# Altium schematic sheet INC-IO1212001.SchDoc
size A2
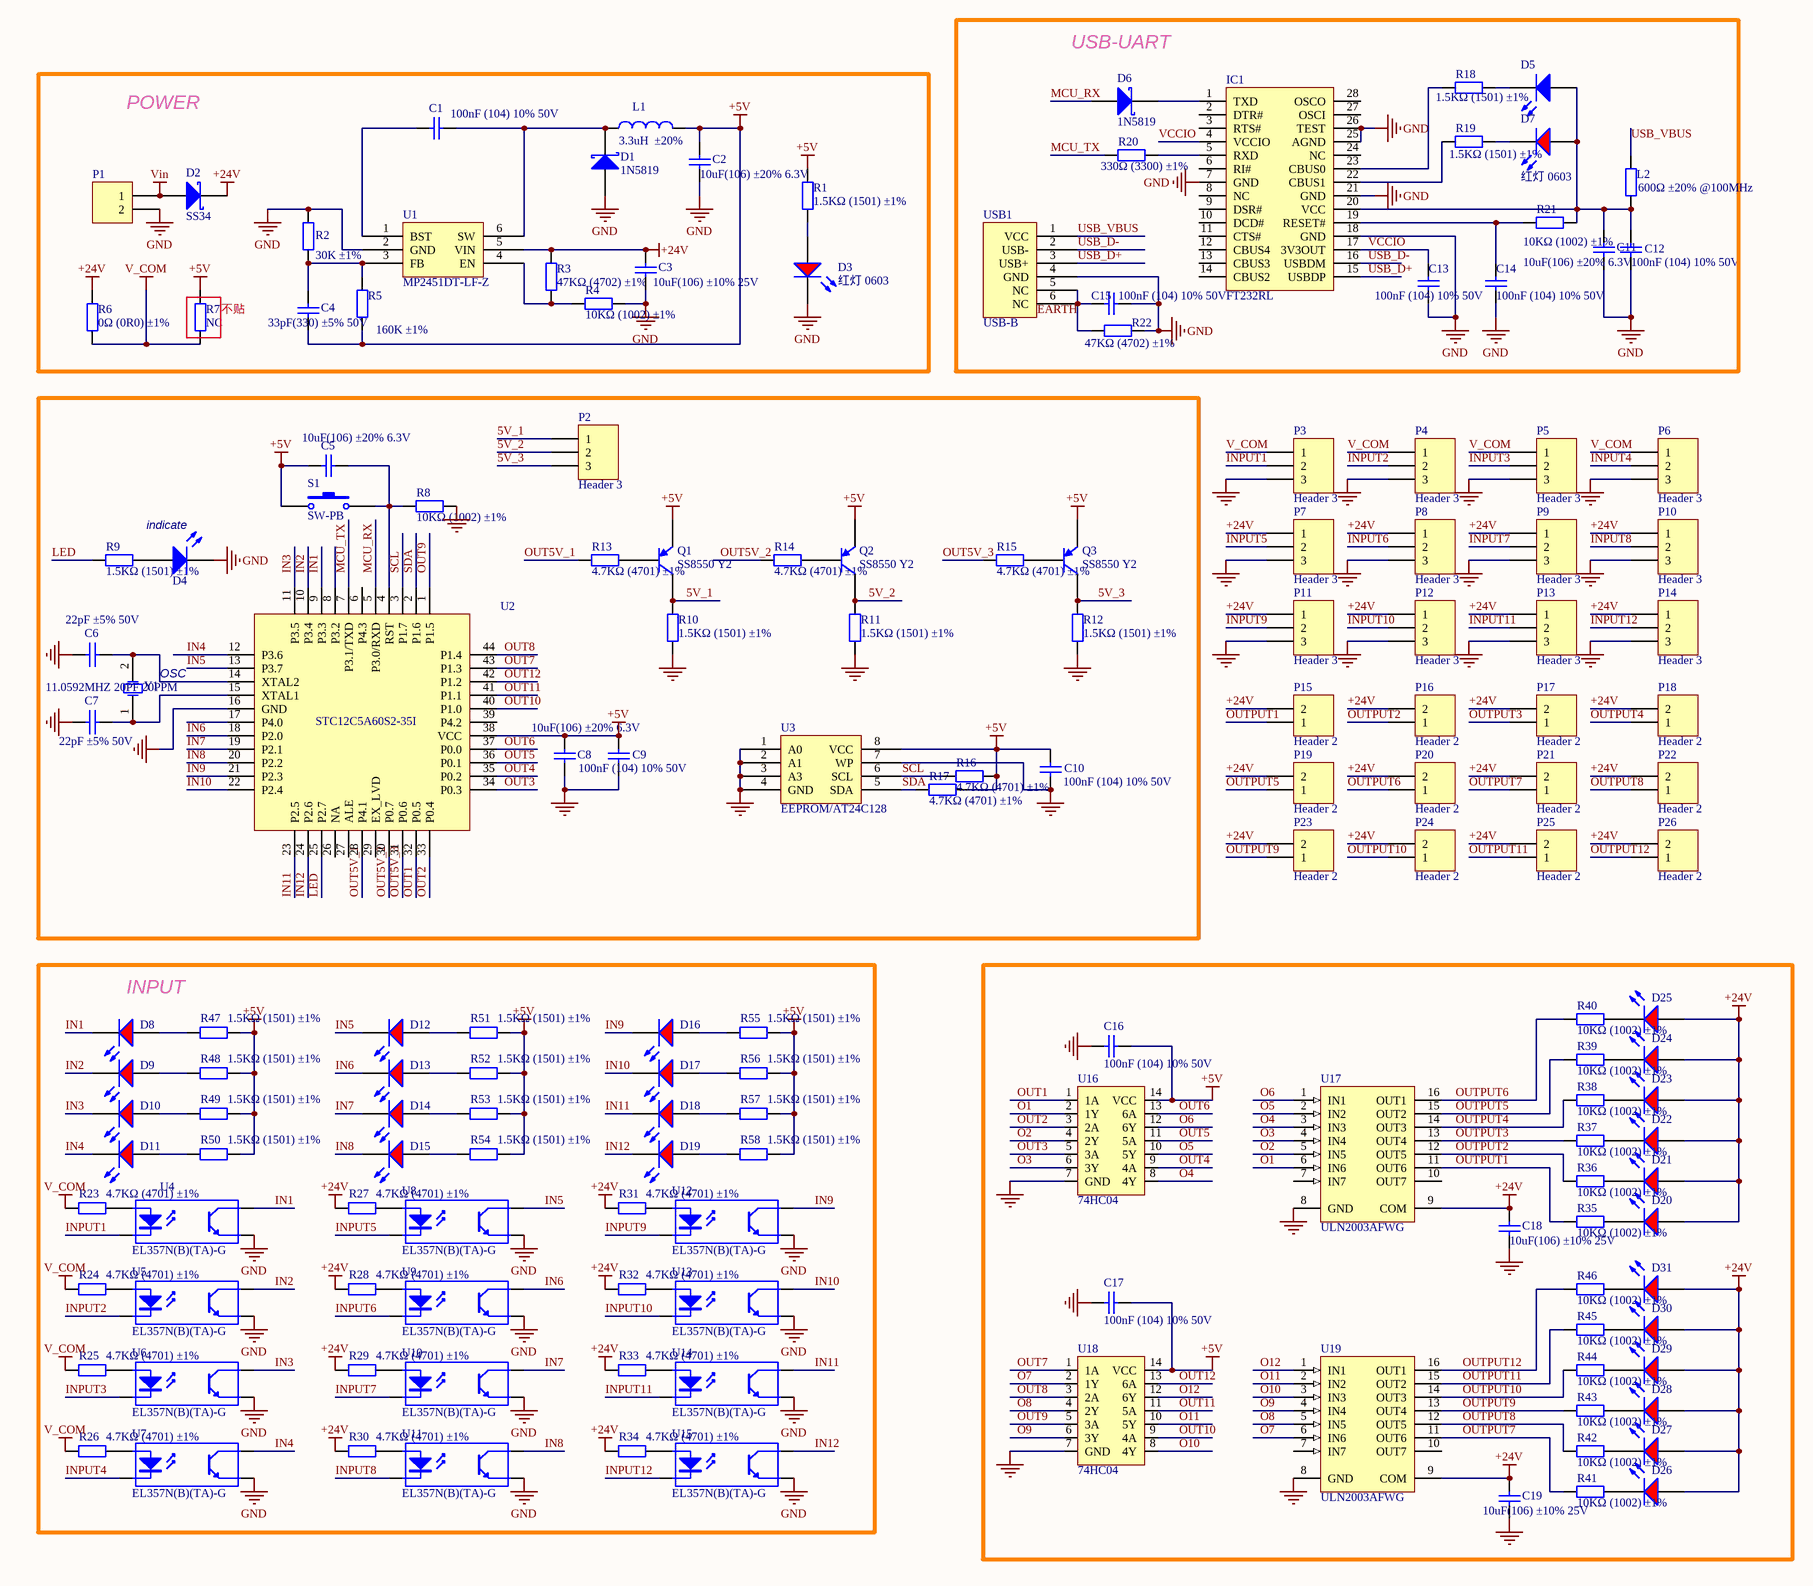
[diagram p0: INC-IO1212001.SchDoc]

## Parts
C1  100nF (104) 10% 50V  [0603_C]
C2  10uF(106) ±20% 6.3V  [0603_C]
C3  10uF(106) ±10% 25V  [1206_C]
C4  33pF(330) ±5% 50V  [0603_C]
C5  10uF(106) ±20% 6.3V  [0603_C]
C6  22pF ±5% 50V  [0603_C]
C7  22pF ±5% 50V  [0603_C]
C8  10uF(106) ±20% 6.3V  [0603_C]
C9  100nF (104) 10% 50V  [0603_C]
C10  100nF (104) 10% 50V  [0603_C]
C11  10uF(106) ±20% 6.3V  [0603_C]
C12  100nF (104) 10% 50V  [0603_C]
C13  100nF (104) 10% 50V  [0603_C]
C14  100nF (104) 10% 50V  [0603_C]
C15  100nF (104) 10% 50V  [0603_C]
C16  100nF (104) 10% 50V  [0603_C]
C17  100nF (104) 10% 50V  [0603_C]
C18  10uF(106) ±10% 25V  [1206_C]
C19  10uF(106) ±10% 25V  [1206_C]
D1  1N5819  [SOD-123]
D2  SS34  [SMA(DO-214AC)_S1]
D3  红灯 0603  [0603_LED_S1]
D4  蓝灯 0603  [0603_LED_S1]  (value not drawn)
D5  蓝灯 0603  [0603_LED_S1]  (value not drawn)
D6  1N5819  [SOD-123]
D7  红灯 0603  [0603_LED_S1]
D8  红灯 0603  [0603_LED_S1]  (value not drawn)
D9  红灯 0603  [0603_LED_S1]  (value not drawn)
D10  红灯 0603  [0603_LED_S1]  (value not drawn)
D11  红灯 0603  [0603_LED_S1]  (value not drawn)
D12  红灯 0603  [0603_LED_S1]  (value not drawn)
D13  红灯 0603  [0603_LED_S1]  (value not drawn)
D14  红灯 0603  [0603_LED_S1]  (value not drawn)
D15  红灯 0603  [0603_LED_S1]  (value not drawn)
D16  红灯 0603  [0603_LED_S1]  (value not drawn)
D17  红灯 0603  [0603_LED_S1]  (value not drawn)
D18  红灯 0603  [0603_LED_S1]  (value not drawn)
D19  红灯 0603  [0603_LED_S1]  (value not drawn)
D20  红灯 0603  [0603_LED_S1]  (value not drawn)
D21  红灯 0603  [0603_LED_S1]  (value not drawn)
D22  红灯 0603  [0603_LED_S1]  (value not drawn)
D23  红灯 0603  [0603_LED_S1]  (value not drawn)
D24  红灯 0603  [0603_LED_S1]  (value not drawn)
D25  红灯 0603  [0603_LED_S1]  (value not drawn)
D26  红灯 0603  [0603_LED_S1]  (value not drawn)
D27  红灯 0603  [0603_LED_S1]  (value not drawn)
D28  红灯 0603  [0603_LED_S1]  (value not drawn)
D29  红灯 0603  [0603_LED_S1]  (value not drawn)
D30  红灯 0603  [0603_LED_S1]  (value not drawn)
D31  红灯 0603  [0603_LED_S1]  (value not drawn)
IC1  FT232RL  [SSOP-28_208mil]
L1  3.3uH  ±20%  [L5020]
L2  600Ω ±20% @100MHz  [0805_L]
P1  Header 2  [GX-2P-3.81MM]  (value not drawn)
P2  Header 3  [GX-3P-3.81MM]
P3  Header 3  [GX-3P-3.81MM]
P4  Header 3  [GX-3P-3.81MM]
P5  Header 3  [GX-3P-3.81MM]
P6  Header 3  [GX-3P-3.81MM]
P7  Header 3  [GX-3P-3.81MM]
P8  Header 3  [GX-3P-3.81MM]
P9  Header 3  [GX-3P-3.81MM]
P10  Header 3  [GX-3P-3.81MM]
P11  Header 3  [GX-3P-3.81MM]
P12  Header 3  [GX-3P-3.81MM]
P13  Header 3  [GX-3P-3.81MM]
P14  Header 3  [GX-3P-3.81MM]
P15  Header 2  [GX-2P-3.81MM]
P16  Header 2  [GX-2P-3.81MM]
P17  Header 2  [GX-2P-3.81MM]
P18  Header 2  [GX-2P-3.81MM]
P19  Header 2  [GX-2P-3.81MM]
P20  Header 2  [GX-2P-3.81MM]
P21  Header 2  [GX-2P-3.81MM]
P22  Header 2  [GX-2P-3.81MM]
P23  Header 2  [GX-2P-3.81MM]
P24  Header 2  [GX-2P-3.81MM]
P25  Header 2  [GX-2P-3.81MM]
P26  Header 2  [GX-2P-3.81MM]
Q1  SS8550 Y2  [SOT-23(SOT-23-3)]
Q2  SS8550 Y2  [SOT-23(SOT-23-3)]
Q3  SS8550 Y2  [SOT-23(SOT-23-3)]
R1  1.5KΩ (1501) ±1%  [0603_R]
R2  30K ±1%  [0603_R]
R3  47KΩ (4702) ±1%  [0603_R]
R4  10KΩ (1002) ±1%  [0603_R]
R5  160K ±1%  [0603_R]
R6  0Ω (0R0) ±1%  [0603_R]
R7  NC  [0603_R]
R8  10KΩ (1002) ±1%  [0603_R]
R9  1.5KΩ (1501) ±1%  [0603_R]
R10  1.5KΩ (1501) ±1%  [0603_R]
R11  1.5KΩ (1501) ±1%  [0603_R]
R12  1.5KΩ (1501) ±1%  [0603_R]
R13  4.7KΩ (4701) ±1%  [0603_R]
R14  4.7KΩ (4701) ±1%  [0603_R]
R15  4.7KΩ (4701) ±1%  [0603_R]
R16  4.7KΩ (4701) ±1%  [0603_R]
R17  4.7KΩ (4701) ±1%  [0603_R]
R18  1.5KΩ (1501) ±1%  [0603_R]
R19  1.5KΩ (1501) ±1%  [0603_R]
R20  330Ω (3300) ±1%  [0603_R]
R21  10KΩ (1002) ±1%  [0603_R]
R22  47KΩ (4702) ±1%  [0603_R]
R23  4.7KΩ (4701) ±1%  [1210_R]
R24  4.7KΩ (4701) ±1%  [1210_R]
R25  4.7KΩ (4701) ±1%  [1210_R]
R26  4.7KΩ (4701) ±1%  [1210_R]
R27  4.7KΩ (4701) ±1%  [1210_R]
R28  4.7KΩ (4701) ±1%  [1210_R]
R29  4.7KΩ (4701) ±1%  [1210_R]
R30  4.7KΩ (4701) ±1%  [1210_R]
R31  4.7KΩ (4701) ±1%  [1210_R]
R32  4.7KΩ (4701) ±1%  [1210_R]
R33  4.7KΩ (4701) ±1%  [1210_R]
R34  4.7KΩ (4701) ±1%  [1210_R]
R35  10KΩ (1002) ±1%  [0603_R]
R36  10KΩ (1002) ±1%  [0603_R]
R37  10KΩ (1002) ±1%  [0603_R]
R38  10KΩ (1002) ±1%  [0603_R]
R39  10KΩ (1002) ±1%  [0603_R]
R40  10KΩ (1002) ±1%  [0603_R]
R41  10KΩ (1002) ±1%  [0603_R]
R42  10KΩ (1002) ±1%  [0603_R]
R43  10KΩ (1002) ±1%  [0603_R]
R44  10KΩ (1002) ±1%  [0603_R]
R45  10KΩ (1002) ±1%  [0603_R]
R46  10KΩ (1002) ±1%  [0603_R]
R47  1.5KΩ (1501) ±1%  [0603_R]
R48  1.5KΩ (1501) ±1%  [0603_R]
R49  1.5KΩ (1501) ±1%  [0603_R]
R50  1.5KΩ (1501) ±1%  [0603_R]
R51  1.5KΩ (1501) ±1%  [0603_R]
R52  1.5KΩ (1501) ±1%  [0603_R]
R53  1.5KΩ (1501) ±1%  [0603_R]
R54  1.5KΩ (1501) ±1%  [0603_R]
R55  1.5KΩ (1501) ±1%  [0603_R]
R56  1.5KΩ (1501) ±1%  [0603_R]
R57  1.5KΩ (1501) ±1%  [0603_R]
R58  1.5KΩ (1501) ±1%  [0603_R]
S1  SW-PB  [SW-3*6*2.5]
U1  MP2451DT-LF-Z  [SOT-23-6]
U2  STC12C5A60S2-35I  [LQFP-44_10x10x08P]
U3  EEPROM/AT24C128  [SOIC-8_150mil]
U4  EL357N(B)(TA)-G  [SOP-4_P2.54]
U5  EL357N(B)(TA)-G  [SOP-4_P2.54]
U6  EL357N(B)(TA)-G  [SOP-4_P2.54]
U7  EL357N(B)(TA)-G  [SOP-4_P2.54]
U8  EL357N(B)(TA)-G  [SOP-4_P2.54]
U9  EL357N(B)(TA)-G  [SOP-4_P2.54]
U10  EL357N(B)(TA)-G  [SOP-4_P2.54]
U11  EL357N(B)(TA)-G  [SOP-4_P2.54]
U12  EL357N(B)(TA)-G  [SOP-4_P2.54]
U13  EL357N(B)(TA)-G  [SOP-4_P2.54]
U14  EL357N(B)(TA)-G  [SOP-4_P2.54]
U15  EL357N(B)(TA)-G  [SOP-4_P2.54]
U16  74HC04  [SOIC-14_150mil]
U17  ULN2003AFWG  [SOIC-16_150mil]
U18  74HC04  [SOIC-14_150mil]
U19  ULN2003AFWG  [SOIC-16_150mil]
USB1  USB-B  [USB-b]
Y1  11.0592MHZ 20PF 20PPM  [SMD-5032_2P]

## Blocks framed on the sheet
USB-UART: C11-C15 D5-D7 IC1 L2 R18-R22 USB1
POWER: C1-C4 D1-D3 L1 P1 R1-R7 U1
INPUT: D8-D19 R23-R34 R47-R58 U4-U15

## Nets
+5V: C2.2 C4.2 C5.2 C8.1 C9.1 C10.1 C16.2 C17.2 L1.2 Q1.2(E) Q2.2(E) Q3.2(E) R1.1 R5.2 R7.2 R16.2 R17.2 R47.2 R48.2 R49.2 R50.2 R51.2 R52.2 R53.2 R54.2 R55.2 R56.2 R57.2 R58.2 S1.1 U2.38(VCC) U3.8(VCC) U16.14(VCC) U18.14(VCC)
+24V: C3.2 C18.2 C19.2 D2.2(K) D20.A D21.A D22.A D23.A D24.A D25.A D26.A D27.A D28.A D29.A D30.A D31.A P7.1 P8.1 P9.1 P10.1 P11.1 P12.1 P13.1 P14.1 P15.2 P16.2 P17.2 P18.2 P19.2 P20.2 P21.2 P22.2 P23.2 P24.2 P25.2 P26.2 R3.1 R6.2 R27.1 R28.1 R29.1 R30.1 R31.1 R32.1 R33.1 R34.1 U1.5(VIN) U17.9(COM) U19.9(COM)
GND: C2.1 C3.1 C6.2 C7.2 C8.2 C9.2 C10.2 C11.1 C12.1 C13.1 C14.1 C15.2 C16.1 C17.1 C18.1 C19.1 D1.1(A) D3.K D4.K IC1.7(GND) IC1.18(GND) IC1.21(GND) IC1.25(AGND) IC1.26(TEST) P1.2 P3.3 P4.3 P5.3 P6.3 P7.3 P8.3 P9.3 P10.3 P11.3 P12.3 P13.3 P14.3 R2.1 R4.2 R8.2 R10.1 R11.1 R12.1 R22.1 U1.2(GND) U2.16(GND) U3.1(A0) U3.2(A1) U3.3(A3) U3.4(GND) U3.7(WP) U4.3(E) U5.3(E) U6.3(E) U7.3(E) U8.3(E) U9.3(E) U10.3(E) U11.3(E) U12.3(E) U13.3(E) U14.3(E) U15.3(E) U16.7(GND) U17.8(GND) U18.7(GND) U19.8(GND) USB1.4(GND)
V_COM: P3.1 P4.1 P5.1 P6.1 R6.1 R7.1 R23.1 R24.1 R25.1 R26.1
Vin: D2.1(A) P1.1
5V_1: P2.1 Q1.3(C) R10.2
5V_2: P2.2 Q2.3(C) R11.2
5V_3: P2.3 Q3.3(C) R12.2
IN1: D8.K U2.9(P3.3) U4.4(C)
IN2: D9.K U2.10(P3.4) U5.4(C)
IN3: D10.K U2.11(P3.5) U6.4(C)
IN4: D11.K U2.12(P3.6) U7.4(C)
IN5: D12.K U2.13(P3.7) U8.4(C)
IN6: D13.K U2.18(P2.0) U9.4(C)
IN7: D14.K U2.19(P2.1) U10.4(C)
IN8: D15.K U2.20(P2.2) U11.4(C)
IN9: D16.K U2.21(P2.3) U12.4(C)
IN10: D17.K U2.22(P2.4) U13.4(C)
IN11: D18.K U2.23(P2.5) U14.4(C)
IN12: D19.K U2.24(P2.6) U15.4(C)
INPUT1: P3.2 U4.2(K)
INPUT2: P4.2 U5.2(K)
INPUT3: P5.2 U6.2(K)
INPUT4: P6.2 U7.2(K)
INPUT5: P7.2 U8.2(K)
INPUT6: P8.2 U9.2(K)
INPUT7: P9.2 U10.2(K)
INPUT8: P10.2 U11.2(K)
INPUT9: P11.2 U12.2(K)
INPUT10: P12.2 U13.2(K)
INPUT11: P13.2 U14.2(K)
INPUT12: P14.2 U15.2(K)
LED: R9.2 U2.25(P2.7)
MCU_RX: D6.1(A) U2.5(P3.0/RXD)
MCU_TX: R20.2 U2.7(P3.1/TXD)
O1: U16.2(1Y) U17.6(IN6)
O2: U16.4(2Y) U17.5(IN5)
O3: U16.6(3Y) U17.4(IN4)
O4: U16.8(4Y) U17.3(IN3)
O5: U16.10(5Y) U17.2(IN2)
O6: U16.12(6Y) U17.1(IN1)
O7: U18.2(1Y) U19.6(IN6)
O8: U18.4(2Y) U19.5(IN5)
O9: U18.6(3Y) U19.4(IN4)
O10: U18.8(4Y) U19.3(IN3)
O11: U18.10(5Y) U19.2(IN2)
O12: U18.12(6Y) U19.1(IN1)
OUT1: U2.32(P0.5) U16.1(1A)
OUT2: U2.33(P0.4) U16.3(2A)
OUT3: U2.34(P0.3) U16.5(3A)
OUT4: U2.35(P0.2) U16.9(4A)
OUT5: U2.36(P0.1) U16.11(5A)
OUT5V_1: R13.1 U2.28(P4.1)
OUT5V_2: R14.1 U2.30(P0.7)
OUT5V_3: R15.1 U2.31(P0.6)
OUT6: U2.37(P0.0) U16.13(6A)
OUT7: U2.43(P1.3) U18.1(1A)
OUT8: U2.44(P1.4) U18.3(2A)
OUT9: U2.1(P1.5) U18.5(3A)
OUT10: U2.40(P1.0) U18.9(4A)
OUT11: U2.41(P1.1) U18.11(5A)
OUT12: U2.42(P1.2) U18.13(6A)
OUTPUT1: P15.1 R35.1 U17.11(OUT6)
OUTPUT2: P16.1 R36.1 U17.12(OUT5)
OUTPUT3: P17.1 R37.1 U17.13(OUT4)
OUTPUT4: P18.1 R38.1 U17.14(OUT3)
OUTPUT5: P19.1 R39.1 U17.15(OUT2)
OUTPUT6: P20.1 R40.1 U17.16(OUT1)
OUTPUT7: P21.1 R41.1 U19.11(OUT6)
OUTPUT8: P22.1 R42.1 U19.12(OUT5)
OUTPUT9: P23.1 R43.1 U19.13(OUT4)
OUTPUT10: P24.1 R44.1 U19.14(OUT3)
OUTPUT11: P25.1 R45.1 U19.15(OUT2)
OUTPUT12: P26.1 R46.1 U19.16(OUT1)
SCL: R16.1 U2.3(P1.7) U3.6(SCL)
SDA: R17.1 U2.2(P1.6) U3.5(SDA)
USB_D+: IC1.15(USBDP) USB1.3(USB+)
USB_D-: IC1.16(USBDM) USB1.2(USB-)
USB_VBUS: L2.2 USB1.1(VCC)
VCCIO: C13.2 IC1.4(VCCIO) IC1.17(3V3OUT)
NetC1_1: C1.1 D1.2(K) L1.1 U1.6(SW)
NetC1_2: C1.2 U1.1(BST)
NetC4_1: C4.1 R2.2 R5.1 U1.3(FB)
NetC5_1: C5.1 R8.1 S1.2 U2.4(RST)
NetC6_1: C6.1 U2.14(XTAL2) Y1.2(OSC2)
NetC7_1: C7.1 U2.15(XTAL1) Y1.1(OSC1)
NetC11_2: C11.2 C12.2 D5.A D7.A IC1.20(VCC) L2.1 R21.1
NetC14_2: C14.2 IC1.19(RESET#) R21.2
NetC15_1: C15.1 R22.2 USB1.5(NC) USB1.6(NC)
NetD3_A: D3.A R1.2
NetD4_A: D4.A R9.1
NetD5_K: D5.K R18.2
NetD6_2: D6.2(K) IC1.1(TXD)
NetD7_K: D7.K R19.2
NetD8_A: D8.A R47.1
NetD9_A: D9.A R48.1
NetD10_A: D10.A R49.1
NetD11_A: D11.A R50.1
NetD12_A: D12.A R51.1
NetD13_A: D13.A R52.1
NetD14_A: D14.A R53.1
NetD15_A: D15.A R54.1
NetD16_A: D16.A R55.1
NetD17_A: D17.A R56.1
NetD18_A: D18.A R57.1
NetD19_A: D19.A R58.1
NetD20_K: D20.K R35.2
NetD21_K: D21.K R36.2
NetD22_K: D22.K R37.2
NetD23_K: D23.K R38.2
NetD24_K: D24.K R39.2
NetD25_K: D25.K R40.2
NetD26_K: D26.K R41.2
NetD27_K: D27.K R42.2
NetD28_K: D28.K R43.2
NetD29_K: D29.K R44.2
NetD30_K: D30.K R45.2
NetD31_K: D31.K R46.2
NetIC1_5: IC1.5(RXD) R20.1
NetIC1_22: IC1.22(CBUS1) R19.1
NetIC1_23: IC1.23(CBUS0) R18.1
NetQ1_1: Q1.1(B) R13.2
NetQ2_1: Q2.1(B) R14.2
NetQ3_1: Q3.1(B) R15.2
NetR3_2: R3.2 R4.1 U1.4(EN)
NetR23_2: R23.2 U4.1(A)
NetR24_2: R24.2 U5.1(A)
NetR25_2: R25.2 U6.1(A)
NetR26_2: R26.2 U7.1(A)
NetR27_2: R27.2 U8.1(A)
NetR28_2: R28.2 U9.1(A)
NetR29_2: R29.2 U10.1(A)
NetR30_2: R30.2 U11.1(A)
NetR31_2: R31.2 U12.1(A)
NetR32_2: R32.2 U13.1(A)
NetR33_2: R33.2 U14.1(A)
NetR34_2: R34.2 U15.1(A)

Not connected (* = marked no-connect by the designer): IC1 2(DTR#) 3(RTS#) 6(RI#) 8(NC) 9(DSR#) 10(DCD#) 11(CTS#) 12(CBUS4) 13(CBUS3) 14(CBUS2) 24(NC) 27(OSCI) 28(OSCO); U2 6(P4.3) 8(P3.2) 17(P4.0) 26(NA) 27(ALE) 29(EX_LVD) 39(P4.2); U17 7(IN7) 10(OUT7); U19 7(IN7) 10(OUT7)

## Notes on the sheet
- (near R7) 不贴
- indicate
- (near Y1) OSC
- Labels drawn without touching a wire or pin: EARTH

## Library data of the parts
C1 C4 = 0603 10nF (103) 10% 50V: 贴片电容; ComponentLink1Description: 供应商链接; ComponentLink1URL: http://www.szlcsc.com/product/details_58143.html; Package: 0603; Supplier: LC; SuppliersPartNumber: C57112
C2 C3 C12-C15 C18 = Cap: Capacitor; Published: 8-Jun-2000; LatestRevisionDate: 17-Jul-2002; LatestRevisionNote: Re-released for DXP Platform.; PackageReference: RAD-0.3; Publisher: Altium Limited
  C2: Value: 10uF(106) ±20% 6.3V
  C3 C18: Value: 10uF(106) ±10% 25V
  C12-C15: Value: 100nF (104) 10% 50V
C5 = 0603 10uF (106) 10% 10V: 贴片电容; ComponentLink1Description: 供应商链接; ComponentLink1URL: http://www.szlcsc.com/product/details_20411.html; Package: 0603; Supplier: LC; SuppliersPartNumber: C19702
C6 C7 = CAP: Capacitor
C8 = Cap: Capacitor; Value: 1uF; Published: 8-Jun-2000; Revision: July-2002: Re-released for DXP Platform.; Publisher: Altium Limited
C9 C10 C16 C17 = Cap: Capacitor; Value: 10nF; Published: 8-Jun-2000; Revision: July-2002: Re-released for DXP Platform.; Publisher: Altium Limited
C11 = Cap: Capacitor; Value: 4.7uF/10V; Published: 8-Jun-2000; LatestRevisionDate: 17-Jul-2002; LatestRevisionNote: Re-released for DXP Platform.; PackageReference: RAD-0.3; Publisher: Altium Limited
C19 = Cap: Capacitor; Value: 10uF/25V; Published: 8-Jun-2000; LatestRevisionDate: 17-Jul-2002; LatestRevisionNote: Re-released for DXP Platform.; PackageReference: RAD-0.3; Publisher: Altium Limited
D1 D2 D6 = D Schottky: Schottky Diode; Published: 8-Jun-2000; LatestRevisionDate: 17-Jul-2002; LatestRevisionNote: Re-released for DXP Platform.; PackageReference: SMB; Publisher: Altium Limited; Code_JEDEC: DO-214-AA
D3 D7-D31 = 0603 红灯: 发光二极管; ComponentLink1Description: 供应商链接; ComponentLink1URL: http://www.szlcsc.com/product/details_2659.html; Package: 0603; Supplier: LC; SuppliersPartNumber: C2286
D4 D5 = 0603 蓝灯: 发光二极管; ComponentLink1Description: 供应商链接; ComponentLink1URL: http://www.szlcsc.com/product/details_73150.html; Package: 0603; Supplier: LC; SuppliersPartNumber: C72041
L1 = Inductor: Code_IEC: 1005; Value: 4.7uH  ±10%; Published: 8-Jun-2000; LatestRevisionDate: 29-May-2009; LatestRevisionNote: IPC-7351 Footprint Added.; PackageReference: 0402-A; Publisher: Altium Limited; PackageDescription: Chip Inductor; Code_JEITA: 0402
L2 R9 R18-R22 = Res2: Resistor; Published: 8-Jun-2000; LatestRevisionDate: 17-Jul-2002; LatestRevisionNote: Re-released for DXP Platform.; PackageReference: AXIAL-0.4; Publisher: Altium Limited
  L2: Value: 600Ω ±20% @100MHz
  R9 R18 R19: Value: 1.5KΩ (1501) ±1%
  R20: Value: 330Ω (3300) ±1%
  R21: Value: 10KΩ (1002) ±1%
  R22: Value: 47KΩ (4702) ±1%
P1 P15-P26 = Header 2: Header, 2-Pin; LatestRevisionDate: 17-Jul-2002; LatestRevisionNote: Re-released for DXP Platform.; Publisher: Altium Limited
P2-P14 = Header 3: Header, 3-Pin; LatestRevisionDate: 17-Jul-2002; LatestRevisionNote: Re-released for DXP Platform.; Publisher: Altium Limited
Q1-Q3 = SOT-23 SS8550 Y2: 三极管; ComponentLink1Description: 供应商链接; ComponentLink1URL: http://www.szlcsc.com/product/details_9037.html; Package: SOT-23; Supplier: LC; SuppliersPartNumber: C8542
R1 R8 R10-R17 R35-R46 = 0603 1KΩ (1001) 1%: 贴片电阻; ComponentLink1Description: 供应商链接; ComponentLink1URL: http://www.szlcsc.com/product/details_21904.html; Package: 0603; Supplier: LC; SuppliersPartNumber: C21190
R2 R5-R7 R23-R34 R47-R58 = 0603 18KΩ (1802) 1%: 贴片电阻; ComponentLink1Description: 供应商链接; ComponentLink1URL: http://www.szlcsc.com/product/details_26553.html; Package: 0603; Supplier: LC; SuppliersPartNumber: C25810
R3 R4 = 0603 100KΩ (1003) 1%: 贴片电阻; ComponentLink1Description: 供应商链接; ComponentLink1URL: http://www.szlcsc.com/product/details_26546.html; Package: 0603; Supplier: LC; SuppliersPartNumber: C25803
S1 = SW-PB: Switch; Published: 24-Mar-1999; LatestRevisionDate: 17-Jul-2002; LatestRevisionNote: Re-released for DXP Platform.; PackageReference: SPST-2; Publisher: Altium Limited; PackageDescription: Switch; 2 Leads
U1 = MP2451DT-LF-Z: DC-DC芯片; ComponentLink1Description: 供应商链接; ComponentLink1URL: http://www.szlcsc.com/product/details_14780.html; Package: SOT-23-6; Supplier: LC; SuppliersPartNumber: C14123
U2 = STC12C5A60S2-35I: MCU; ComponentLink1Description: 供应商链接; ComponentLink1URL: http://www.szlcsc.com/product/details_9202.html; Package: LQFP-44_10x10x08P; Supplier: LC; SuppliersPartNumber: C8696
U3 = EEPROM/AT24C256C-SSHL-T: EEPROM; ComponentLink1Description: 供应商链接; ComponentLink1URL: http://www.szlcsc.com/product/details_6947.html; Package: SOIC-8_150mil; Supplier: LC; SuppliersPartNumber: C6482
U4-U15 = EL357N(B)(TA)-G: 贴片光耦; ComponentLink1Description: 供应商链接; ComponentLink1URL: http://www.szlcsc.com/product/details_7114.html; Package: SOP-4_P2.54; Supplier: LC; SuppliersPartNumber: C6649
U17 U19 = ULN2003AFWG: 大电流驱动; ComponentLink1Description: 供应商链接; ComponentLink1URL: http://www.szlcsc.com/product/details_5880.html; Package: SOIC-16_150mil; Supplier: LC; SuppliersPartNumber: C5437
USB1 = USB-6
Y1 = SMD-5032_2P 11.0592MHZ 20PF 20PPM: 贴片晶振; ComponentLink1Description: 供应商链接; ComponentLink1URL: http://www.szlcsc.com/product/details_53039.html; Package: SMD-5032_2P; Supplier: LC; SuppliersPartNumber: C52026